# Altium schematic sheet Microcontroller.SchDoc
size A4
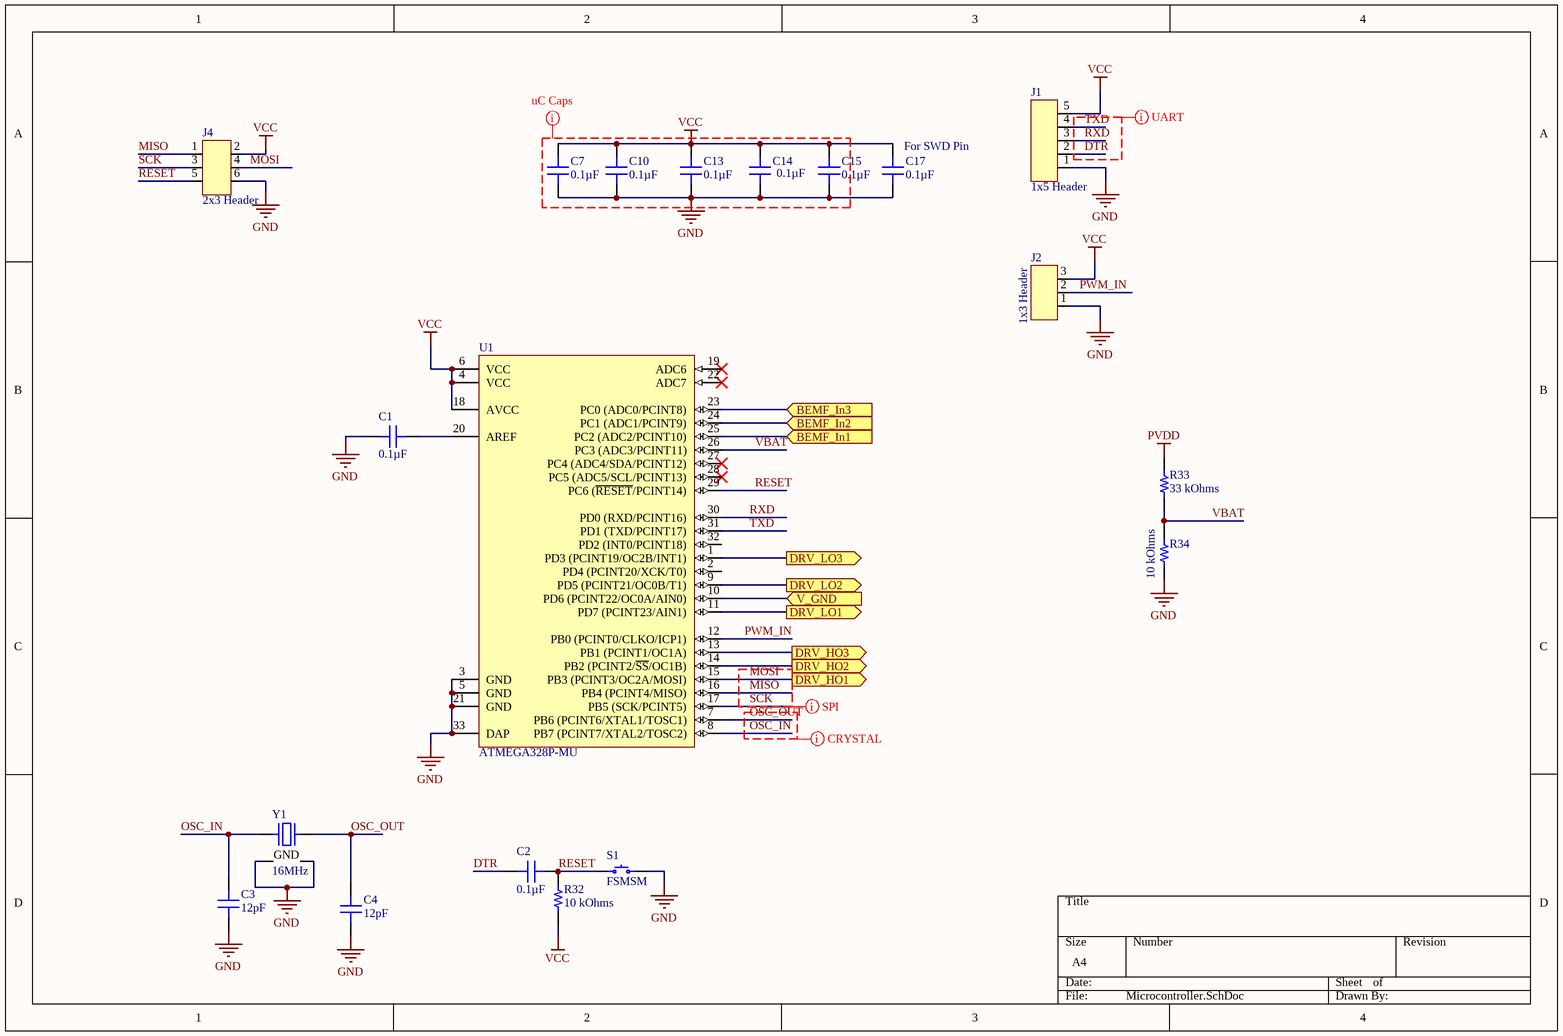
[diagram p0: Microcontroller.SchDoc]

## Parts
C1  0.1µF  [CAP 0603_1608]
C2  0.1µF  [CAP 0603_1608]
C3  12pF  [CAP 0402_1005]
C4  12pF  [CAP 0402_1005]
C7  0.1µF  [CAP 0603_1608]
C10  0.1µF  [CAP 0603_1608]
C13  0.1µF  [CAP 0603_1608]
C14  0.1µF  [CAP 0603_1608]
C15  0.1µF  [CAP 0603_1608]
C17  0.1µF  [CAP 0603_1608]
J1  1x5 Header  [1X5-HEADER]
J2  1x3 Header  [1x3Header]
J4  2x3 Header  [3x2 Header]
R32  10 kOhms  [RES 0805_2012]
R33  33 kOhms  [RES 0805_2012]
R34  10 kOhms  [RES 0805_2012]
S1  FSMSM  [TE FSMSMTR]
U1  ATMEGA328P-MU  [QFN50P500X500X100_HS-33N]
Y1  16MHz  [NDK NX2520SA]

## Ports
BEMF_In1 (in), BEMF_In2 (in), BEMF_In3 (in), DRV_HO1 (out), DRV_HO2 (out), DRV_HO3 (out), DRV_LO1 (out), DRV_LO2 (out), DRV_LO3 (out), V_GND (in)

## Nets
GND: C1.2 C3.1 C4.1 C7.1 C10.1 C13.1 C14.1 C15.1 C17.2 J1.1 J2.1 J4.6 R34.1 S1.2 U1.3(GND) U1.5(GND) U1.21(GND) U1.33(DAP) Y1.2(GND) Y1.4(GND)
PVDD: R33.2
VCC: C7.2 C10.2 C13.2 C14.2 C15.2 C17.1 J1.5 J2.3 J4.2 R32.2 U1.4(VCC) U1.6(VCC) U1.18(AVCC)
BEMF_In1: U1.25(PC2_(ADC2/PCINT10)) ; port BEMF_In1
BEMF_In2: U1.24(PC1_(ADC1/PCINT9)) ; port BEMF_In2
BEMF_In3: U1.23(PC0_(ADC0/PCINT8)) ; port BEMF_In3
DRV_HO2: U1.14(PB2_(PCINT2/~{SS}/OC1B)) ; port DRV_HO2
DRV_HO3: U1.13(PB1_(PCINT1/OC1A)) ; port DRV_HO3
DRV_LO1: U1.11(PD7_(PCINT23/AIN1)) ; port DRV_LO1
DRV_LO2: U1.9(PD5_(PCINT21/OC0B/T1)) ; port DRV_LO2
DRV_LO3: U1.1(PD3_(PCINT19/OC2B/INT1)) ; port DRV_LO3
DTR: C2.2 J1.2
MISO: J4.1 U1.16(PB4_(PCINT4/MISO))
MOSI: J4.4 U1.15(PB3_(PCINT3/OC2A/MOSI)) ; port DRV_HO1
OSC_IN: C3.2 U1.8(PB7_(PCINT7/XTAL2/TOSC2)) Y1.1
OSC_OUT: C4.2 U1.7(PB6_(PCINT6/XTAL1/TOSC1)) Y1.3
PWM_IN: J2.2 U1.12(PB0_(PCINT0/CLKO/ICP1))
RESET: C2.1 J4.5 R32.1 S1.1 U1.29(PC6_(~{RESET}/PCINT14))
RXD: J1.3 U1.30(PD0_(RXD/PCINT16))
SCK: J4.3 U1.17(PB5_(SCK/PCINT5))
TXD: J1.4 U1.31(PD1_(TXD/PCINT17))
V_GND: U1.10(PD6_(PCINT22/OC0A/AIN0)) ; port V_GND
VBAT: R33.1 R34.2 U1.26(PC3_(ADC3/PCINT11))
NetC1_1: C1.1 U1.20(AREF)

Not connected (* = marked no-connect by the designer): U1 2(PD4_(PCINT20/XCK/T0)) 19(ADC6)* 22(ADC7)* 27(PC4_(ADC4/SDA/PCINT12))* 28(PC5_(ADC5/SCL/PCINT13))* 32(PD2_(INT0/PCINT18))

## Layout directives
Object Class: uC: GND, VCC
net class Programming Pins: DTR, RXD, TXD
net class SPI Pins: SCK
net class Crystal Pinsw: OSC_IN, OSC_OUT

## Notes on the sheet
- (near C17) For SWD Pin

## Library data of the parts
C1 C2 C7 C10 C13-C15 C17 = CML0603X7R104KT50V: CAP CER 0.1UF 50V X7R 0603; Manufacturer: Stackpole Electronics Inc; Tolerance: ±10%; Part Number: CML0603X7R104KT50V; Value: 0.1µF; Applications: General Purpose; Capacitance: 0.1µF; ComponentLink1Description: Datasheet; ComponentLink1URL: http://www.seielect.com/Catalog/SEI-CML.PDF; ComponentLink2Description: DigiKey Link; ComponentLink2URL: http://digikey.com/product-detail/en/stackpole-electronics-inc/CML0603X7R104KT50V/738-CML0603X7R104KT50VCT-ND/10660220; Device Package: 0603 (1608 Metric); LastUpdated: 2.9.2020 01:03:28; Lifecycle Status: Active; Minimum Order: 1; Mounting Type: Surface Mount, MLCC; Operating Temperature: -55°C ~ 125°C; Package / Case: 0603 (1608 Metric); Packaging: Unknown; PartId: 26324; Part Status: Active; Price: 0.01; Series: CML_X7R; Supplier 1: DigiKey; Supplier Part Number 1: 738-CML0603X7R104KT50VCT-ND; Temperature Coefficient: X7R; Voltage - Rated: 50V
C3 C4 = 04025U120GAT2A: CAP CER 12PF 50V NP0 0402; Manufacturer: AVX Corporation; Temperature Coefficient: C0G, NP0; Tolerance: ±2%; Part Number: 04025U120GAT2A; Value: 12pF; Applications: RF, Microwave, High Frequency; Capacitance: 12pF; ComponentLink1Description: Datasheet; ComponentLink1URL: http://datasheets.avx.com/U-Series.pdf; ComponentLink2Description: DigiKey Link; ComponentLink2URL: http://digikey.com/product-detail/en/avx-corporation/04025U120GAT2A/478-10137-1-ND/6797158; Device Package: 0402 (1005 Metric); Features: Ultra Low ESR; LastUpdated: 2.9.2020 01:01:29; Lifecycle Status: Active; Minimum Order: 1; Mounting Type: Surface Mount, MLCC; Operating Temperature: -55°C ~ 125°C; Package / Case: 0402 (1005 Metric); Packaging: TapeAndReel; PartId: 12930; Part Status: Active; Price: 0.05; Series: U; Size / Dimension: 0.039" L x 0.020" W (1.00mm x 0.50mm); Supplier 1: DigiKey; Supplier Part Number 1: 478-10137-1-ND; Thickness (Max): 0.022" (0.55mm); Voltage - Rated: 50V
J1 = 1x5 Header: 1X5 Male Header 2.54mm
J2 = 1x3 Header: 1x3 Male Header 2.54mm
J4 = 2x3 Header: 2x3 Male Header 2.54mm
R32 = CRT0805-BY-1002EST: RESTHINFILM 0805 10K0 0.1% 125MW; Manufacturer: Bourns Inc.; Power (Watts): 0.125W, 1/8W; Temperature Coefficient: ±25ppm/°C; Part Number: CRT0805-BY-1002EST; Value: 10 kOhms; ComponentLink1Description: Datasheet; ComponentLink1URL: https://www.bourns.com/docs/Product-Datasheets/CRT-ST.pdf; ComponentLink2Description: DigiKey Link; ComponentLink2URL: http://digikey.com/product-detail/en/bourns-inc/CRT0805-BY-1002EST/CRT0805-BY-1002ESTCT-ND/7928093; Composition: Thin Film; Device Package: 0805 (2012 Metric); Features: Current Sense; Height - Seated (Max): 0.024" (0.60mm); LastUpdated: 2.9.2020 01:14:26; Lifecycle Status: Active; Minimum Order: 1; Number of Terminations: 2; Operating Temperature: -55°C ~ 155°C; Package / Case: 0805 (2012 Metric); Packaging: TapeAndReel; PartId: 49388; Part Status: Active; Price: 0.04; Resistance: 10 kOhms; Series: CRT-ST; Size / Dimension: 0.079" L x 0.049" W (2.00mm x 1.25mm); Supplier 1: DigiKey; Supplier Part Number 1: CRT0805-BY-1002ESTCT-ND; Supplier Device Package: 0805; Tolerance: ±0.1%
R33 = CR0805-FX-3302ELF: RES SMD 33K OHM 1% 1/8W 0805; Manufacturer: Bourns Inc.; Power (Watts): 0.125W, 1/8W; Temperature Coefficient: ±100ppm/°C; Part Number: CR0805-FX-3302ELF; Value: 33 kOhms; ComponentLink1Description: Datasheet; ComponentLink1URL: https://www.bourns.com/docs/Product-Datasheets/CHPREZTR.pdf; ComponentLink2Description: DigiKey Link; ComponentLink2URL: http://digikey.com/product-detail/en/bourns-inc/CR0805-FX-3302ELF/CR0805-FX-3302ELFCT-ND/4247928; Composition: Thick Film; Device Package: 0805 (2012 Metric); Features: Moisture Resistant; Height - Seated (Max): 0.024" (0.60mm); LastUpdated: 2.9.2020 01:14:29; Lifecycle Status: Active; Minimum Order: 1; Number of Terminations: 2; Operating Temperature: -55°C ~ 155°C; Package / Case: 0805 (2012 Metric); Packaging: TapeAndReel; PartId: 48969; Part Status: Active; Price: 0.01; Resistance: 33 kOhms; Series: CR0805; Size / Dimension: 0.079" L x 0.049" W (2.00mm x 1.25mm); Supplier 1: DigiKey; Supplier Part Number 1: CR0805-FX-3302ELFCT-ND; Supplier Device Package: 0805; Tolerance: ±1%
R34 = RN73R2ATTD1002F25: RES 10K OHM 1% 1/8W 0805; Manufacturer: KOA Speer Electronics, Inc.; Power (Watts): 0.125W, 1/8W; Temperature Coefficient: ±25ppm/°C; Part Number: RN73R2ATTD1002F25; Value: 10 kOhms; ComponentLink1Description: Datasheet; ComponentLink1URL: //media.digikey.com/pdf/Data%20Sheets/KOA%20Speer/RN73R_Type_DS.pdf; ComponentLink2Description: DigiKey Link; ComponentLink2URL: http://digikey.com/product-detail/en/koa-speer-electronics-inc/RN73R2ATTD1002F25/2019-RN73R2ATTD1002F25CT-ND/11476953; Composition: Metal Film; Device Package: 0805 (2012 Metric); Features: Moisture Resistant; LastUpdated: 2.9.2020 01:14:23; Lifecycle Status: Active; Minimum Order: 1; Number of Terminations: 2; Operating Temperature: -55°C ~ 155°C; Package / Case: 0805 (2012 Metric); Packaging: TapeAndReel; PartId: 50100; Part Status: Active; Price: 0.06; Resistance: 10 kOhms; Series: RN73R; Supplier 1: DigiKey; Supplier Part Number 1: 2019-RN73R2ATTD1002F25CT-ND; Supplier Device Package: 0805; Tolerance: ±1%
S1 = FSMSM: SWITCH TACTILE SPST-NO 0.05A 24V; Manufacturer: TE Connectivity ALCOSWITCH Switches; Actuator Height off PCB, Vertical: 4.57mm; Actuator Orientation: Top Actuated; Actuator Type: Standard; Contact Rating @ Voltage: 0.05A @ 24VDC; Illumination: Non-Illuminated; Operating Force: 180gf; Outline: 6.00mm x 3.50mm; Switch Function: Off-Mom; Part Number: FSMSM; Circuit: SPST-NO; ComponentLink1Description: Datasheet; ComponentLink1URL: https://www.te.com/commerce/DocumentDelivery/DDEController?Action=srchrtrv&DocNm=1437566-3&DocType=Customer+Drawing&DocLang=English; ComponentLink2Description: DigiKey Link; ComponentLink2URL: http://digikey.com/product-detail/en/te-connectivity-alcoswitch-switches/FSMSM/450-1140-ND/525812; LastUpdated: 2.9.2020 01:27:08; Lifecycle Status: Active; Minimum Order: 1; Mounting Type: Surface Mount; Operating Temperature: -35°C ~ 85°C; Packaging: Bulk; Part Status: Active; Price: 0.27; Series: FSMSM; Supplier 1: DigiKey; Supplier Part Number 1: 450-1140-ND; Termination Style: Gull Wing
U1 = ATMEGA328P-MU: 8-bit AVR Microcontroller, 32KB Flash, 1KB EEPROM, 2KB SRAM, 32-pin MLF, Industrial Grade (-40°C to 85°C); Code_JEDEC: MO-220-VHHD-2; PackageVersion: revE, May-2006; DatasheetVersion: revA, Jan-2010; PackageDescription: 32-Pin Micro Lead Frame Package (MLF),  5 x 5 x 1.0 mm Body, Pitch 0.50 mm, 3.10mm Exposed Pad; PackageReference: 32M1-A; PartNumber: ATMEGA328P-MU
Y1 = NX2520SA-16MHZ-EXS00A-CS11340: CRYSTAL 16MHZ 8PF SMD; Manufacturer: NDK America, Inc.; ESR (Equivalent Series Resistance): 80 Ohms; Frequency Stability: ±15ppm; Operating Mode: Fundamental; Part Number: NX2520SA-16MHZ-EXS00A-CS11340; ComponentLink1Description: Datasheet; ComponentLink1URL: //media.digikey.com/pdf/Data%20Sheets/NDK%20PDFs/NX2520SA-16MHz-EXS00A-CS11340.pdf; ComponentLink2Description: DigiKey Link; ComponentLink2URL: http://digikey.com/product-detail/en/ndk-america-inc/NX2520SA-16MHZ-EXS00A-CS11340/644-1327-1-ND/8275445; Frequency: 16MHz; Frequency Tolerance: ±15ppm; Height - Seated (Max): 0.022" (0.55mm); LastUpdated: 2.9.2020 01:21:57; Lifecycle Status: Active; Load Capacitance: 8pF; Minimum Order: 1; Mounting Type: Surface Mount; Operating Temperature: -10°C ~ 70°C; Package / Case: 4-SMD, No Lead; Packaging: TapeAndReel; PartId: 525; Part Status: Active; Price: 0.73; Series: NX2520SA; Size / Dimension: 0.098" L x 0.079" W (2.50mm x 2.00mm); Supplier 1: DigiKey; Supplier Part Number 1: 644-1327-1-ND; Type: MHz Crystal; Value: 16MHz